# Altium schematic sheet Power.SchDoc
size A
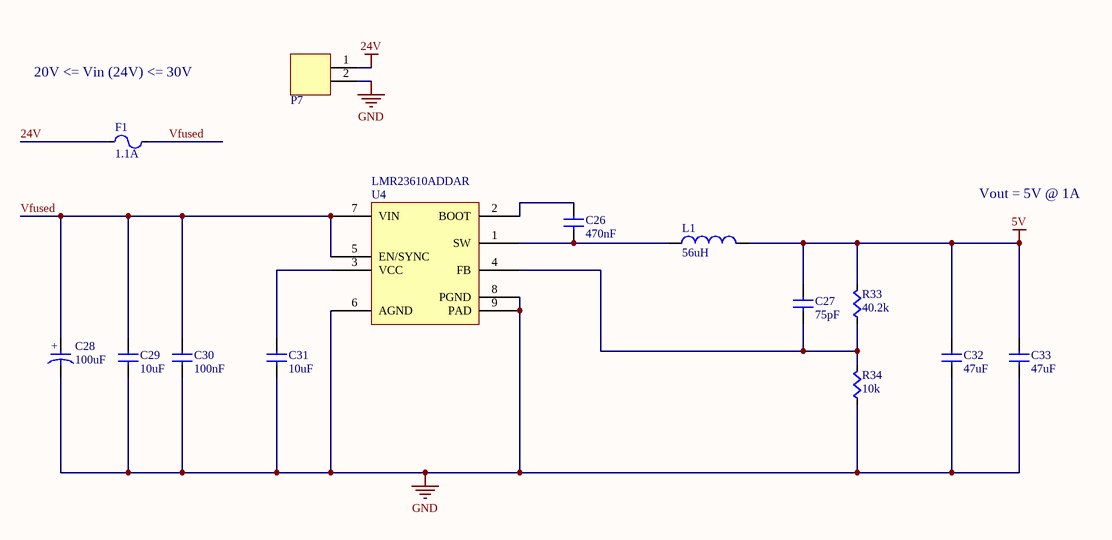
[diagram p0: Power.SchDoc]

## Parts
C26  value 470nF  [CAPC0603]  (hidden comment: Cap)
C27  value 75pF  [CAPC0603]  (hidden comment: Cap)
C28  value 100uF  [EEHZA1H101P]  (hidden comment: EEHZA1H101P)
C29  value 10uF  [CAP1210]  (hidden comment: Cap)
C30  value 100nF  [CAPC0603]  (hidden comment: Cap)
C31  value 10uF  [CAPC0603]  (hidden comment: Cap)
C32  value 47uF  [CAP1210]  (hidden comment: Cap)
C33  value 47uF  [CAP1210]  (hidden comment: Cap)
F1  value 1.1A  [PTC7451X11N]  (hidden comment: PTC Fuse)
L1  value 56uH  [MSS1048-563MLB]  (hidden comment: MSS1048-563MLB)
P7  2-pin Vert Sherlock  [MOLEX-HDR-1X2-SHERLOCK-VERT]  (value not drawn)
R33  value 40.2k  [RES0603]  (hidden comment: Res)
R34  value 10k  [RES0603]  (hidden comment: Res)
U4  LMR23610ADDAR  [LMR23610ADDAR]

## Nets
5V: C27.1(A) C32.1(A) C33.1(A) L1.2 R33.1(A)
24V: F1.1(A) P7.1
GND: C28.2 C29.2(B) C30.2(B) C31.2(B) C32.2(B) C33.2(B) P7.2 R34.2(B) U4.6(AGND) U4.8(PGND) U4.9(PAD)
Vfused: C28.1 C29.1(A) C30.1(A) F1.2(B) U4.5(EN/SYNC) U4.7(VIN)
NetC26_1: C26.1(A) U4.2(BOOT)
NetC26_2: C26.2(B) L1.1 U4.1(SW)
NetC27_2: C27.2(B) R33.2(B) R34.1(A) U4.4(FB)
NetC31_1: C31.1(A) U4.3(VCC)

## Notes on the sheet
- 20V <= Vin (24V) <= 30V
- Vout = 5V @ 1A
- (in symbol EEHZA1H101P) +

## Library data of the parts
C28 = EEHZA1H101P: CAP ALUM POLY HYB 100UF 50V SMD; Manufacturer 1: Panasonic; Tolerance: 20%; Supplier 1: Digi-Key; Supplier Part Number 1: P15442CT-ND; Manufacturer Part Number 1: EEHZA1H101P; Voltage: 50V; ComponentLink1URL: https://na.industrial.panasonic.com/products/capacitors/aluminum-electrolytic-capacitors/conductive-polymer-hybrid-aluminum-electrolytic/series/za-high-temp-reflow/ABA0135/model/EEHZA1H101P; ComponentLink1Description: Web Site; ComponentLink2URL: https://industrial.panasonic.com/cdbs/www-data/pdf/RDD0000/ABA0000C1221.pdf; ComponentLink2Description: Data Sheet; ComponentLink3URL: https://industrial.panasonic.com/cdbs/www-data/pdf/RDD0000/ABA0000COS44.pdf; ComponentLink3Description: ZA Series Technical Data
F1 = PTC_Fuse: Supplier 1: Digi-Key; Supplier Part Number 1: 507-1744-1-ND
L1 = MSS1048-563MLB: FIXED IND 56UH 1.7A 126 MOHM; Manufacturer 1: Coilcraft; Manufacturer Part Number 1: MSS1048-563MLB; ComponentLink1Description: Web Site; ComponentLink1URL: https://www.coilcraft.com/mss1048.cfm; Supplier 1: Coilcraft; Supplier Part Number 1: MSS1048-563MLB
P7 = MOLEX-HDR-1x2-SHERLOCK_VERT: Header, Molex, 2mm Pitch Sherlock Header, Single Row, Vertical, 2 Circuits, Length 3.3mm, 0353620250; Manufacturer Part Number: *; Order Part Number: *
U4 = LMR23610ADDAR: IC REG BUCK ADJ 1A SYNC 8SOPWRPD; Manufacturer 1: Texas Instruments; Supplier 1: Digi-Key; Supplier Part Number 1: 296-47267-1-ND; Manufacturer Part Number 1: LMR23610ADDAR; ComponentLink1URL: http://www.ti.com/lit/ds/symlink/lmr23610.pdf; ComponentLink1Description: Datasheet; ComponentLink2URL: http://www.ti.com/product/LMR23610/description; ComponentLink2Description: Web Site
C26 C27 C29-C33 = Cap: Supplier 1: Digi-Key
  C30: Supplier Part Number 1: 1276-1000-1-ND
  C32 C33: Supplier Part Number 1: 490-6538-1-ND
R33 R34 = Res: Supplier 1: Digi-Key
  R33: Supplier Part Number 1: RMCF0603FT40K2CT-ND
  R34: Supplier Part Number 1: RMCF0603JT10K0CT-ND